# Altium schematic sheet Main.SchDoc
size A4; SheetNumber: 2; SheetTotal: 5
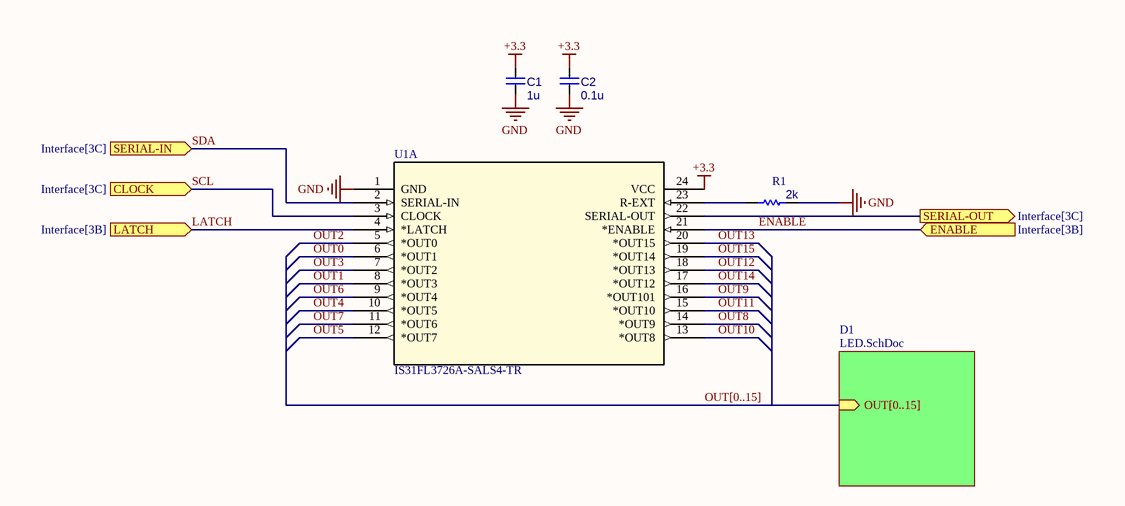
[diagram p0: Main.SchDoc]

## Parts
C1  value 1u  [C0603B]  (hidden comment: Capacitor)
C2  value 0.1u  [C0603B]  (hidden comment: Capacitor)
R1  value 2k  [R0603B]  (hidden comment: Resistor)
U1  IS31FL3726A-SALS4-TR  [SSOP-24_LMS]  (part A of 2)

## Sub-sheets
D1 = LED.SchDoc: OUT[0..15] (in)

## Ports
CLOCK (in, see Interface[3C]), ENABLE (in, see Interface[3B]), LATCH (in, see Interface[3B]), SERIAL-IN (in, see Interface[3C]), SERIAL-OUT (out, see Interface[3C])

## Nets
+3.3: C1.1 C2.1 U1.24(VCC)
GND: C1.2 C2.2 R1.2 U1.1(GND)
ENABLE: U1.21(*ENABLE) ; port ENABLE
LATCH: U1.4(*LATCH) ; port LATCH
OUT0: U1.6(*OUT1)
OUT1: U1.8(*OUT3)
OUT2: U1.5(*OUT0)
OUT3: U1.7(*OUT2)
OUT4: U1.10(*OUT5)
OUT5: U1.12(*OUT7)
OUT6: U1.9(*OUT4)
OUT7: U1.11(*OUT6)
OUT8: U1.14(*OUT9)
OUT9: U1.16(*OUT101)
OUT10: U1.13(*OUT8)
OUT11: U1.15(*OUT10)
OUT12: U1.18(*OUT13)
OUT13: U1.20(*OUT15)
OUT14: U1.17(*OUT12)
OUT15: U1.19(*OUT14)
SCL: U1.3(CLOCK) ; port CLOCK
SDA: U1.2(SERIAL-IN) ; port SERIAL-IN
SERIAL-OUT: U1.22(SERIAL-OUT) ; port SERIAL-OUT
NetR1_1: R1.1 U1.23(R-EXT)

## Buses and harness runs
bus OUT[0..15] = sheet D1/OUT[0..15]

## Library data of the parts
C1 C2 = CMP-001-00000-10: Non-polarized capacitor
R1 = CMP-009-00002-14
U1 = CMP-184-000001-2: LED Driver IC 16 Output Linear Shift Register No Dimming 25.2mA 24-eTSSOP; Mfr_Name: Lumissil Microsystems; RefDes: RefDes; Design Item ID: IS31FL3726A-SALS4-TR; Type: Type; Source: IS31FL3726A-SALS4-TR.SchLib